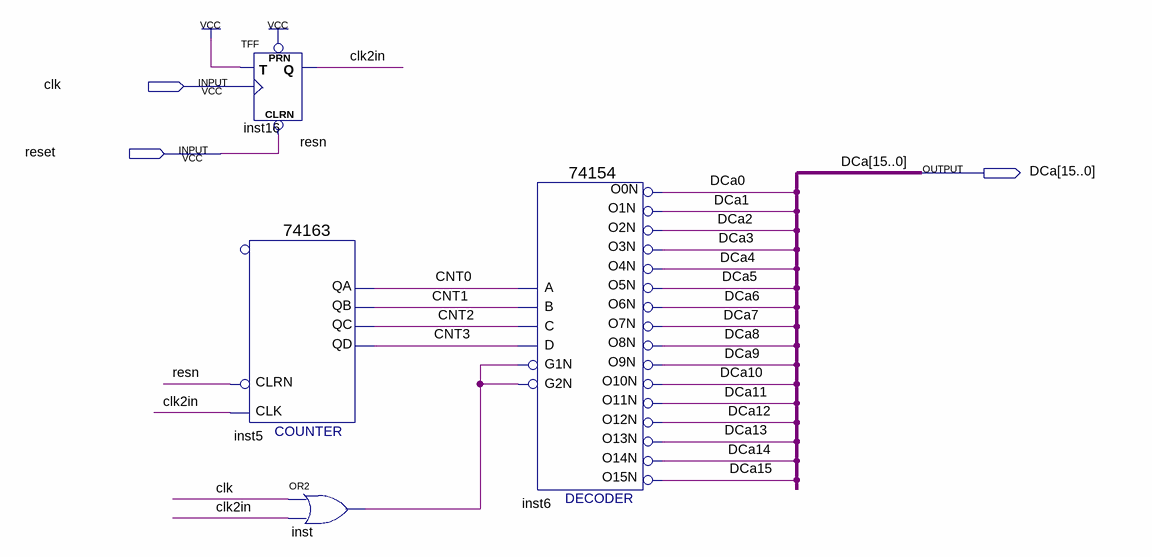
[diagram p0: schematic sheet]
// Quartus schematic DCaGen.bdf as structural Verilog: 4 symbols, 3 pins
module DCaGen (
  input  clk,
  input  reset,
  output [15:0] DCa
);

  wire clk2in, CNT0, CNT1, CNT2, CNT3, inst_out;

  TFF inst16 (.PRN(1'b1), .CLRN(reset), .T(1'b1), .CLK(clk), .Q(clk2in));
  \74163  inst5 (.CLRN(reset), .CLK(clk2in), .QA(CNT0), .QB(CNT1), .QC(CNT2), .QD(CNT3));
  or inst (inst_out, clk, clk2in);
  \74154  inst6 (
    .C(CNT2), .D(CNT3), .B(CNT1), .A(CNT0), .G1N(inst_out), .G2N(inst_out), .O0N(DCa[0]), .O12N(DCa[12]),
    .O15N(DCa[15]), .O10N(DCa[10]), .O11N(DCa[11]), .O1N(DCa[1]), .O13N(DCa[13]), .O14N(DCa[14]),
    .O4N(DCa[4]), .O3N(DCa[3]), .O2N(DCa[2]), .O7N(DCa[7]), .O6N(DCa[6]), .O5N(DCa[5]), .O9N(DCa[9]),
    .O8N(DCa[8]));

  // Other names for the same wires on the sheet: resn = reset
endmodule
